# EasyEDA Pro project 2024-4T-MNT-3.eprj

# Schematic EDA-TEST2
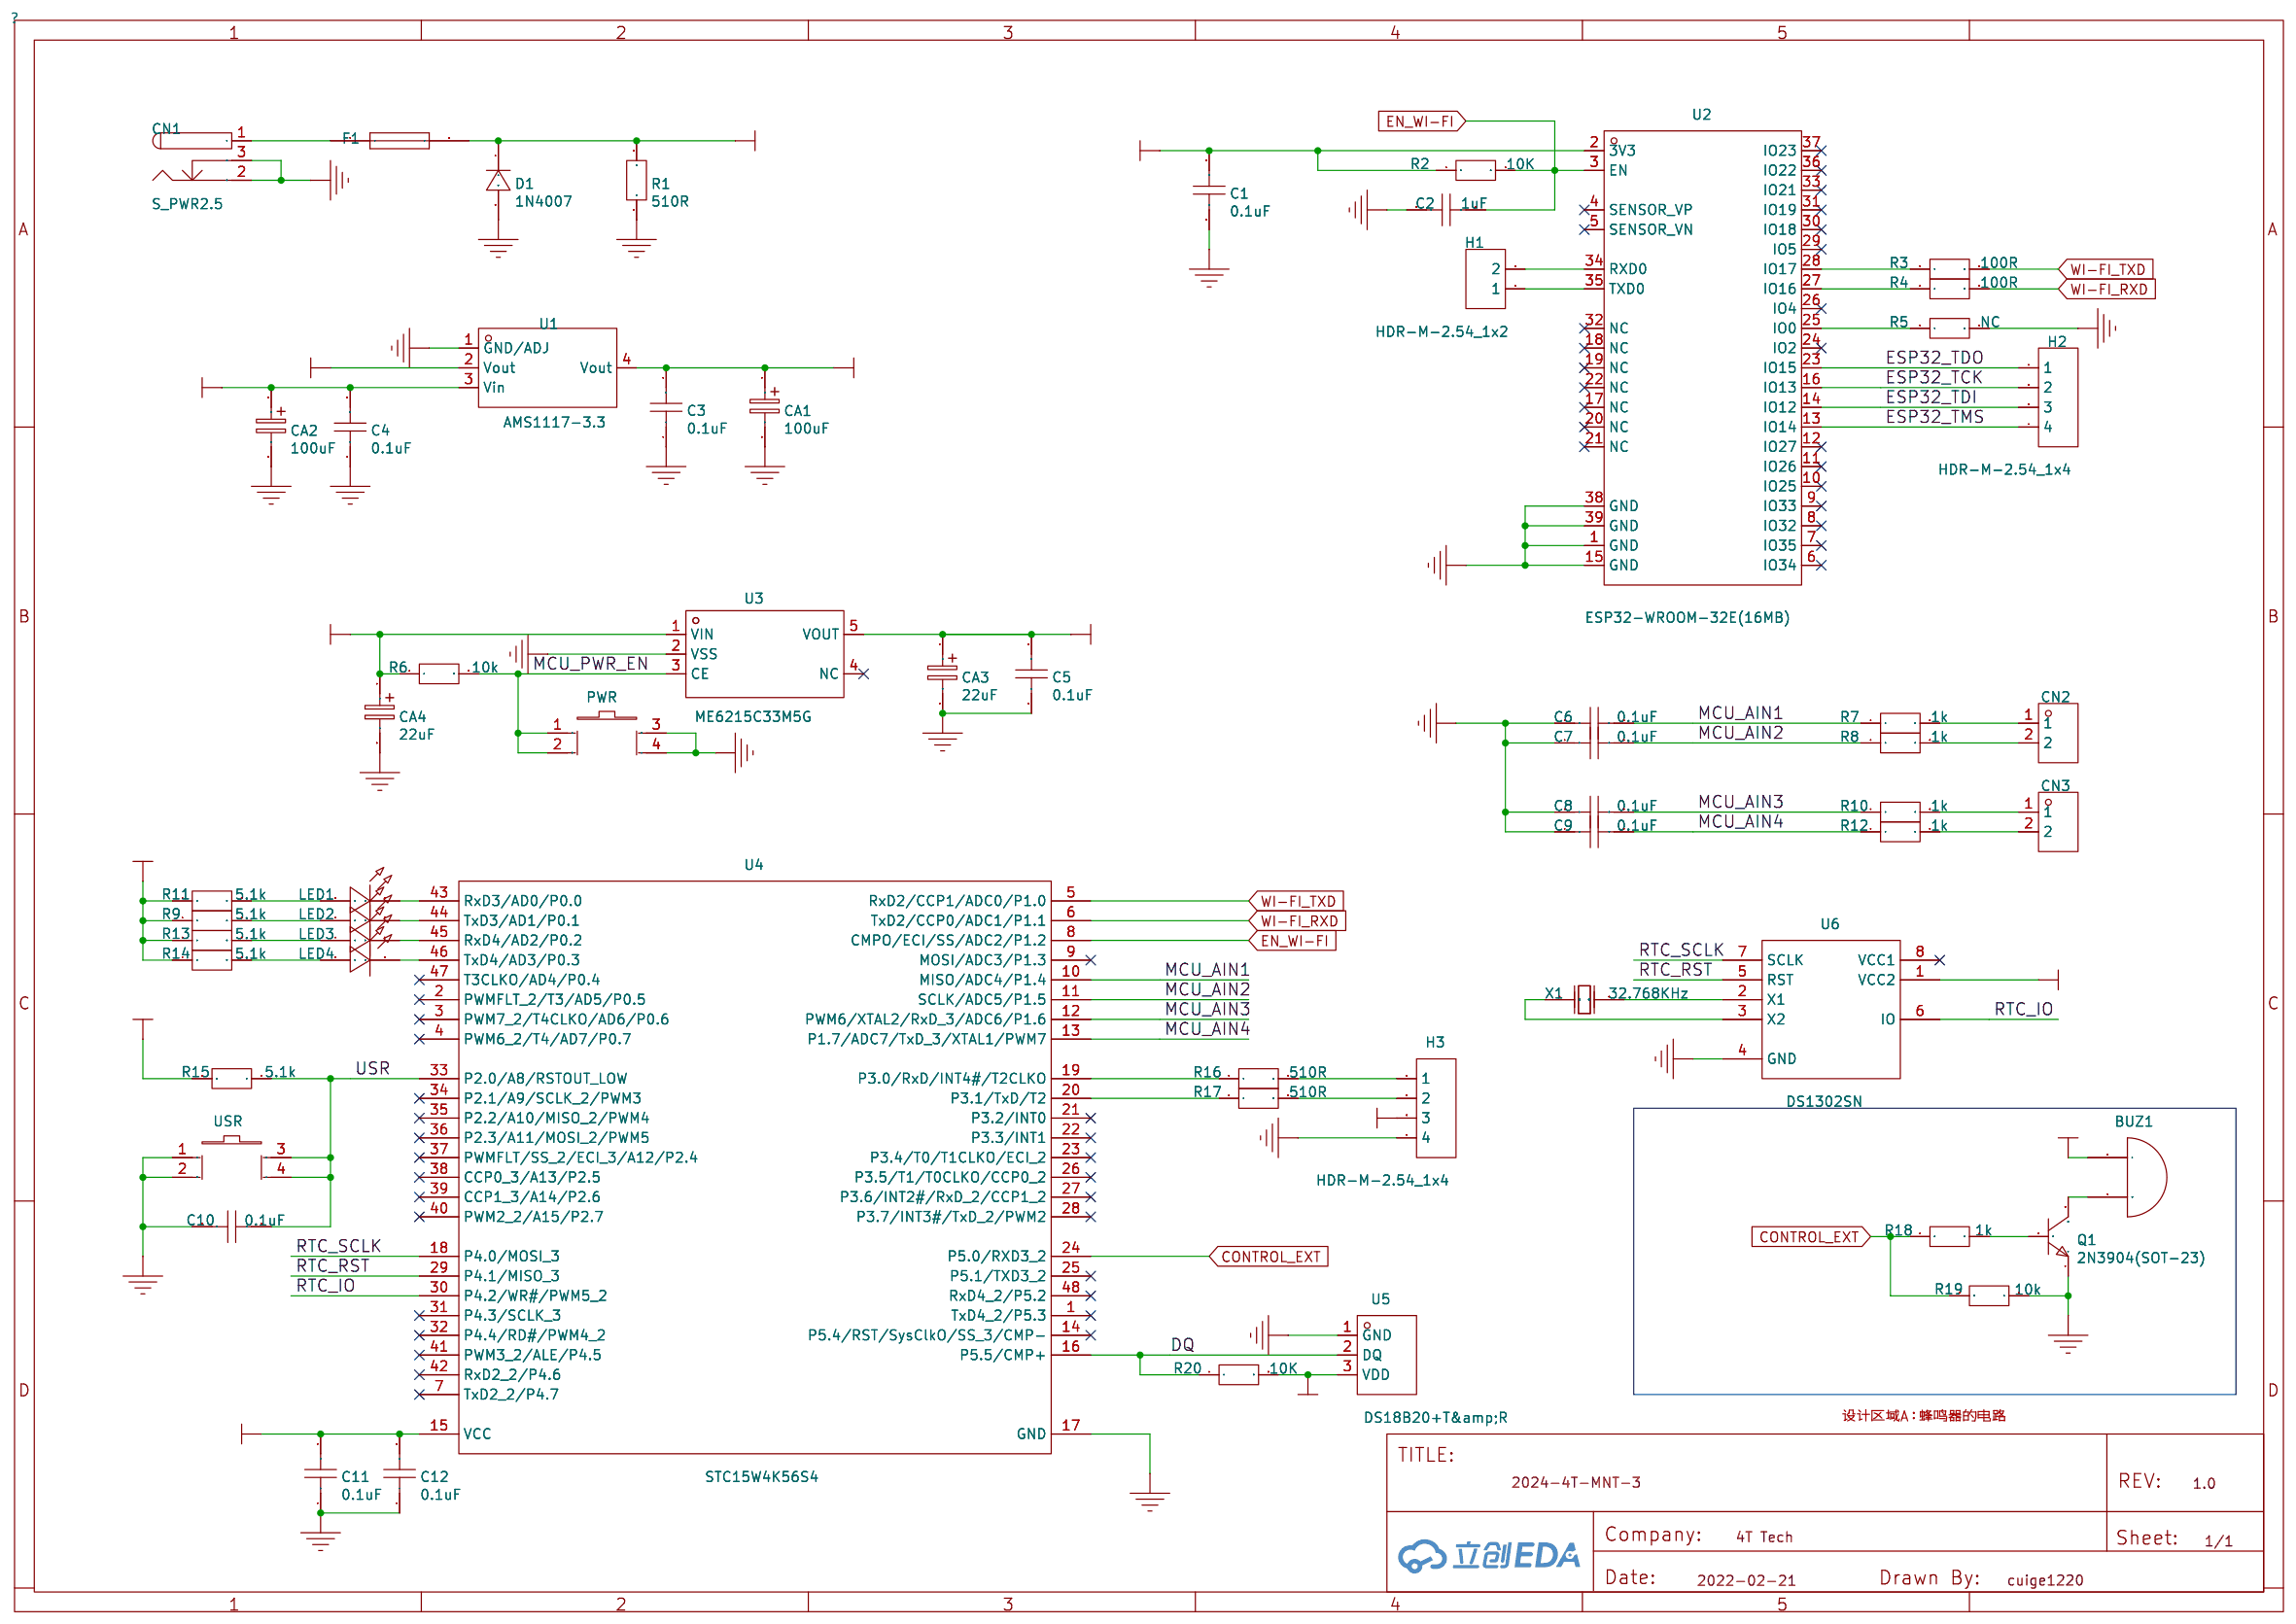
[diagram p0: schematic sheet]

## Parts
BUZ1  BUZ1  [BUZZ]
C1  0.1uF  [C0805]
C2  1uF  [C0805]
C3  0.1uF  [C0805]
C4  0.1uF  [C0805]
C5  0.1uF  [C0805]
C6  0.1uF  [C0805]
C7  0.1uF  [C0805]
C8  0.1uF  [C0805]
C9  0.1uF  [C0805]
C10  0.1uF  [C0805]
C11  0.1uF  [C0805]
C12  0.1uF  [C0805]
CA1  100uF  [C_CAP-6*H]
CA2  100uF  [C_CAP-6*H]
CA3  22uF  [C_CAP-6*H]
CA4  22uF  [C_CAP-6*H]
CN1  S_PWR2.5  [PWR2.5]
CN2  DB128L-5.08-2P  [SIP2-5.08-A]
CN3  DB128L-5.08-2P  [SIP2-5.08-A]
D1  1N4007  [DIODE-0.8]
F1  ASMD1210-075  [R_R1210]
H1  HDR-M-2.54_1x2  [HDR-M-2.54_1X2]
H2  HDR-M-2.54_1x4  [HDR-M-2.54_1X4]
H3  HDR-M-2.54_1x4  [HDR-M-2.54_1X4]
LED1  LED-TH-3mm_R  [D_LED-5MM]
LED2  LED-TH-3mm_R  [D_LED-5MM]
LED3  LED-TH-3mm_R  [D_LED-5MM]
LED4  LED-TH-3mm_R  [D_LED-5MM]
PWR  6x6x6Plastic head  [SW-SMD_4P]
Q1  2N3904(SOT-23)  [SOT-23-3_L2.9-W1.3-P1.90-LS2.4-BR]
R1  510R  [R0805]
R2  10K  [R0805]
R3  100R  [R0805]
R4  100R  [R0805]
R5  NC  [R0805]
R6  10k  [R0805]
R7  1k  [R0805]
R8  1k  [R0805]
R9  5.1k  [R0805]
R10  1k  [R0805]
R11  5.1k  [R0805]
R12  1k  [R0805]
R13  5.1k  [R0805]
R14  5.1k  [R0805]
R15  5.1k  [R0805]
R16  510R  [R0805]
R17  510R  [R0805]
R18  1k  [R0805]
R19  10k  [R0805]
R20  10K  [R0805]
U1  AMS1117-3.3  [SOP-SOT-223]
U2  ESP32-WROOM-32E(16MB)  [ESP32-WROOM-32E]
U3  ME6215C33M5G  [SOP-5]
U4  STC15W4K56S4  [QFP-LQFP-48]
U5  DS18B20+T&amp;R  [T092CS]
U6  DS1302SN  [SOP-8_L4.9-W3.9-P1.27-LS6.0-BL]
USR  6x6x6Plastic head  [SW-SMD_4P]
X1  32.768KHz  [XTAL-DT38]

## Library data of the parts
BUZ1 = BUZ1
C1 C3-C12 = 0.1uF
C2 = 1uF
CA1 CA2 = 100uF
CA3 CA4 = 22uF
CN1 = S_PWR2.5
CN2 CN3 = DB128L-5.08-2P: Supplier: LCSC; Supplier Part: C395868; Manufacturer: DIBO
D1 = 1N4007: Supplier: LCSC; Manufacturer: SEMTECH; Supplier Part: C106903
F1 = ASMD1210-075: Published: 8-Jun-2000; LatestRevisionDate: 17-Jul-2002; LatestRevisionNote: Re-released for DXP Platform.; PackageReference: PIN-W2/E2.8; Publisher: Altium Limited; PackageDescription: Thru-Hole; 2 Leads
H1 = HDR-M-2.54_1x2: Supplier Part: C124375; Supplier: LCSC
H2 H3 = HDR-M-2.54_1x4: Supplier Part: C124378; Supplier: LCSC
LED1-LED4 = 204-10SDRD/S530-A3-L: Manufacturer: EVERLIGHT(台湾亿光); Supplier Part: C84774; Supplier: LCSC
PWR USR = 6x6x6Plastic head: Supplier Part: C23550; Supplier: LCSC; Manufacturer: ReliaPro; image: http://image.lceda.cn/szlcsc/C23550.jpg
Q1 = 2n3904S-RTK/PS: Supplier: LCSC; Manufacturer: KEC; Supplier Part: C18536; Paste Type: SOT-23
R1 R16 R17 = 510R
R2 R6 R19 R20 = 10k
R3 R4 = 100R
R5 = NC
R7 R8 R10 R12 R18 = 1k
R9 R11 R13-R15 = 5.1k
U1 = AMS1117-3.3: Supplier: LCSC; Manufacturer: AMS; image: //image.lceda.cn/szlcsc/C6186.jpg; Supplier Part: C6186; JLCPCB Part Class: Basic; JLCPCB SMD: Yes
U2 = ESP32-WROOM-32E(16MB): Supplier: LCSC; Supplier Part: C701343; Manufacturer: Espressif Systems; JLCPCB Part Class: Extended Part
U3 = ME6215C33M5G: Supplier: LCSC; Manufacturer: MICRONE; Supplier Part: C84119; JLCPCB Part Class: Extend
U4 = STC15W4K56S4: Supplier: LCSC; Manufacturer: STC; image: //image.lceda.cn/szlcsc/C81639.jpg; Supplier Part: C81639; JLCPCB Part Class: Extend
U5 = DS18B20+T&R: Supplier: LCSC; Supplier Part: C880672; Manufacturer: MAXIM(美信); JLCPCB Part Class: Extended Part
U6 = DS1302SN: Trickle Charge Timekeeping Chip
X1 = CFS-20632768EZFB: Supplier: LCSC; Supplier Part: C326534; Manufacturer: CITIZEN

## Nets
3.3V_MCU: BUZ1.1(A) C5.2 C11.2 C12.2 CA3.1 H3.3 R9.1 R11.1 R13.1 R14.1 R15.2 R20.2 U3.5(VOUT) U4.15(VCC) U5.3(VDD) U6.1(VCC2)
3.3V_WIFI: C1.2 C3.2 CA1.1 R2.1 U1.2(Vout) U1.4(Vout) U2.2(3V3)
+5V0: C4.2 CA2.1 CA4.1 D1.1 F1.2 R1.2 R6.1 U1.3(Vin) U3.1(VIN)
GND: C1.1 C2.2 C3.1 C4.1 C5.1 C6.1 C7.1 C8.1 C9.1 C10.2 C11.1 C12.1 CA1.2 CA2.2 CA3.2 CA4.2 CN1.2 CN1.3 D1.2 H3.4 PWR.3 PWR.4 Q1.1(E) R1.1 R5.2 R19.1 U1.1(GND/ADJ) U2.1(GND) U2.15(GND) U2.38(GND) U2.39(GND) U3.2(VSS) U4.17(GND) U5.1(GND) U6.4(GND) USR.1 USR.2
CONTROL_EXT: R18.2 R19.2 U4.24(P5.0/RXD3_2)
DQ: R20.1 U4.16(P5.5/CMP+) U5.2(DQ)
EN_WI-FI: C2.1 R2.2 U2.3(EN) U4.8(CMPO/ECI/SS/ADC2/P1.2)
ESP32_TCK: H2.2 U2.16(IO13)
ESP32_TDI: H2.3 U2.14(IO12)
ESP32_TDO: H2.1 U2.23(IO15)
ESP32_TMS: H2.4 U2.13(IO14)
MCU_AIN1: C6.2 R7.1 U4.10(MISO/ADC4/P1.4)
MCU_AIN2: C7.2 R8.1 U4.11(SCLK/ADC5/P1.5)
MCU_AIN3: C8.2 R10.1 U4.12(PWM6/XTAL2/RxD_3/ADC6/P1.6)
MCU_AIN4: C9.2 R12.1 U4.13(P1.7/ADC7/TxD_3/XTAL1/PWM7)
MCU_PWR_EN: PWR.1 PWR.2 R6.2 U3.3(CE)
RTC_IO: U4.30(P4.2/WR#/PWM5_2) U6.6(IO)
RTC_RST: U4.29(P4.1/MISO_3) U6.5(RST)
RTC_SCLK: U4.18(P4.0/MOSI_3) U6.7(SCLK)
USR: C10.1 R15.1 U4.33(P2.0/A8/RSTOUT_LOW) USR.3 USR.4
WI-FI_RXD: R4.2 U4.6(TxD2/CCP0/ADC1/P1.1)
WI-FI_TXD: R3.2 U4.5(RxD2/CCP1/ADC0/P1.0)
$1N157: R4.1 U2.27(IO16)
$1N158: R3.1 U2.28(IO17)
$1N183: H1.2 U2.34(RXD0)
$1N184: H1.1 U2.35(TXD0)
$1N223: R5.1 U2.25(IO0)
$1N393: CN2.1 R7.2
$1N403: CN2.2 R8.2
$1N404: CN3.1 R10.2
$1N405: CN3.2 R12.2
$1N495: CN1.1 F1.1
$1N538: R16.1 U4.19(P3.0/RxD/INT4#/T2CLKO)
$1N539: H3.1 R16.2
$1N549: R17.1 U4.20(P3.1/TxD/T2)
$1N550: H3.2 R17.2
$1N579: LED1.1 R9.2
$1N580: LED1.2 U4.43(RxD3/AD0/P0.0)
$1N581: LED2.1 R11.2
$1N601: LED3.1 R13.2
$1N621: LED4.1 R14.2
$1N641: LED3.2 U4.45(RxD4/AD2/P0.2)
$1N642: LED4.2 U4.46(TxD4/AD3/P0.3)
$1N643: LED2.2 U4.44(TxD3/AD1/P0.1)
$1N806: U6.2(X1) X1.2(OSC2)
$1N807: U6.3(X2) X1.1(OSC1)
$1N3385: BUZ1.2(B) Q1.3(C)
$1N3396: Q1.2(B) R18.1

Not connected (* = marked no-connect by the designer): U2 4(SENSOR_VP)* 5(SENSOR_VN)* 6(IO34)* 7(IO35)* 8(IO32)* 9(IO33)* 10(IO25)* 11(IO26)* 12(IO27)* 17(NC)* 18(NC)* 19(NC)* 20(NC)* 21(NC)* 22(NC)* 24(IO2)* 26(IO4)* 29(IO5)* 30(IO18)* 31(IO19)* 32(NC)* 33(IO21)* 36(IO22)* 37(IO23)*; U3 4(NC)*; U4 1(TxD4_2/P5.3)* 2(PWMFLT_2/T3/AD5/P0.5)* 3(PWM7_2/T4CLKO/AD6/P0.6)* 4(PWM6_2/T4/AD7/P0.7)* 7(TxD2_2/P4.7)* 9(MOSI/ADC3/P1.3)* 14(P5.4/RST/SysClkO/SS_3/CMP-)* 21(P3.2/INT0)* 22(P3.3/INT1)* 23(P3.4/T0/T1CLKO/ECI_2)* 25(P5.1/TXD3_2)* 26(P3.5/T1/T0CLKO/CCP0_2)* 27(P3.6/INT2#/RxD_2/CCP1_2)* 28(P3.7/INT3#/TxD_2/PWM2)* 31(P4.3/SCLK_3)* 32(P4.4/RD#/PWM4_2)* 34(P2.1/A9/SCLK_2/PWM3)* 35(P2.2/A10/MISO_2/PWM4)* 36(P2.3/A11/MOSI_2/PWM5)* 37(PWMFLT/SS_2/ECI_3/A12/P2.4)* 38(CCP0_3/A13/P2.5)* 39(CCP1_3/A14/P2.6)* 40(PWM2_2/A15/P2.7)* 41(PWM3_2/ALE/P4.5)* 42(RxD2_2/P4.6)* 47(T3CLKO/AD4/P0.4)* 48(RxD4_2/P5.2)*; U6 8(VCC1)*

## Notes on the sheet
- 设计区域A：蜂鸣器的电路

# Board PCB9
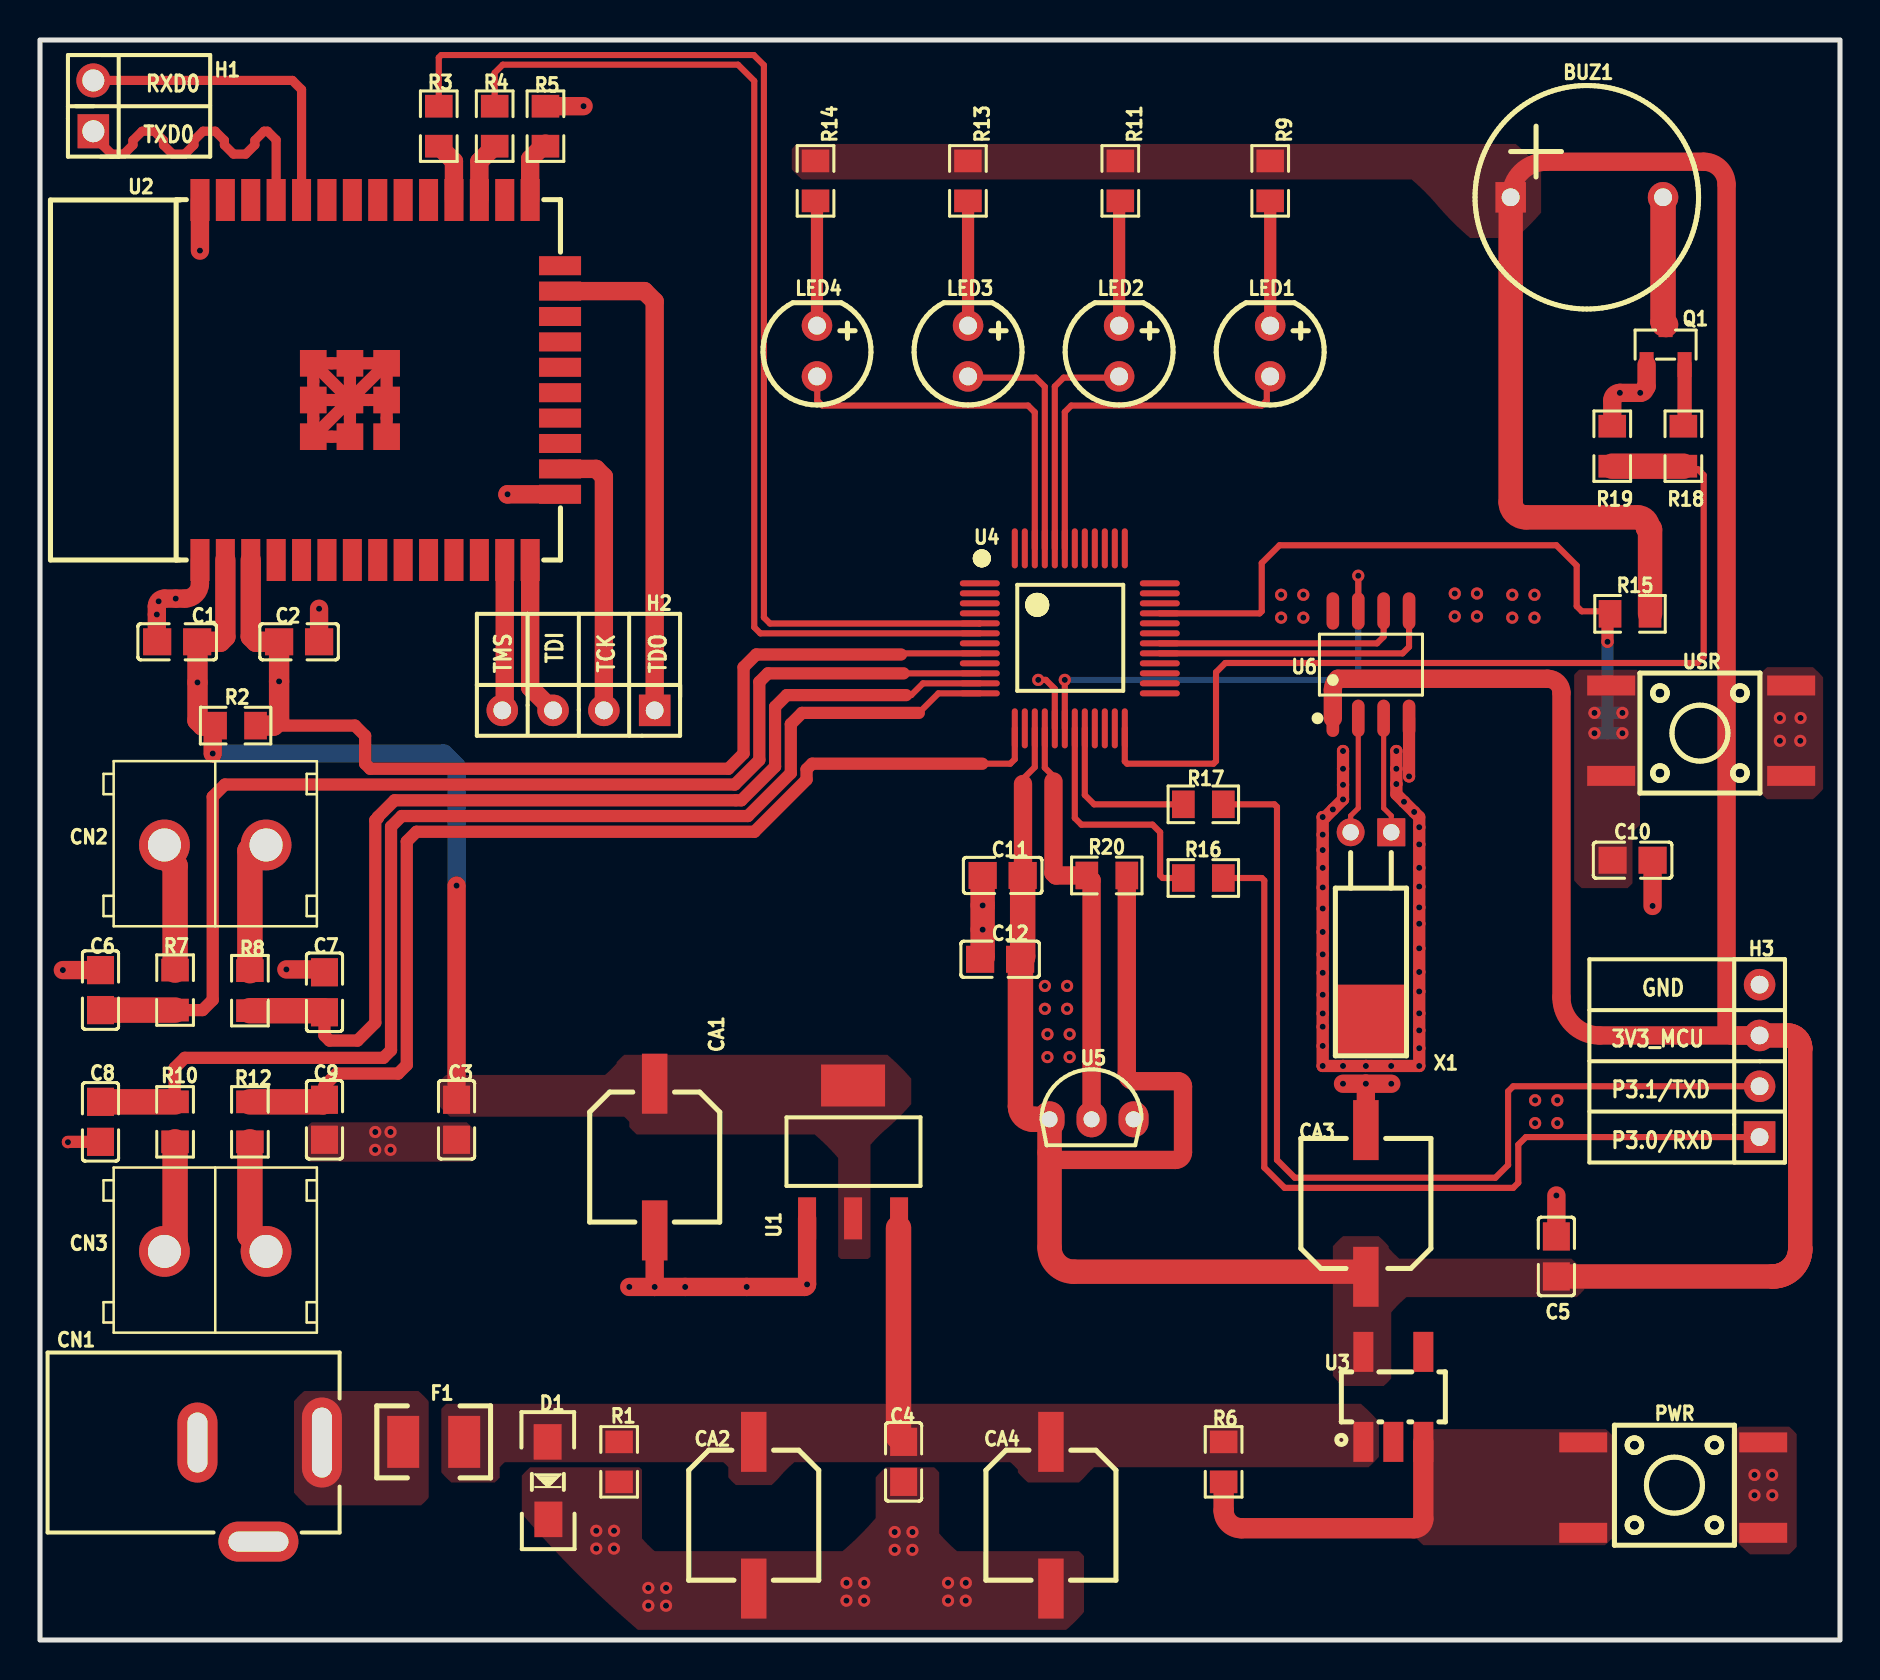
[diagram p1: board, top side]
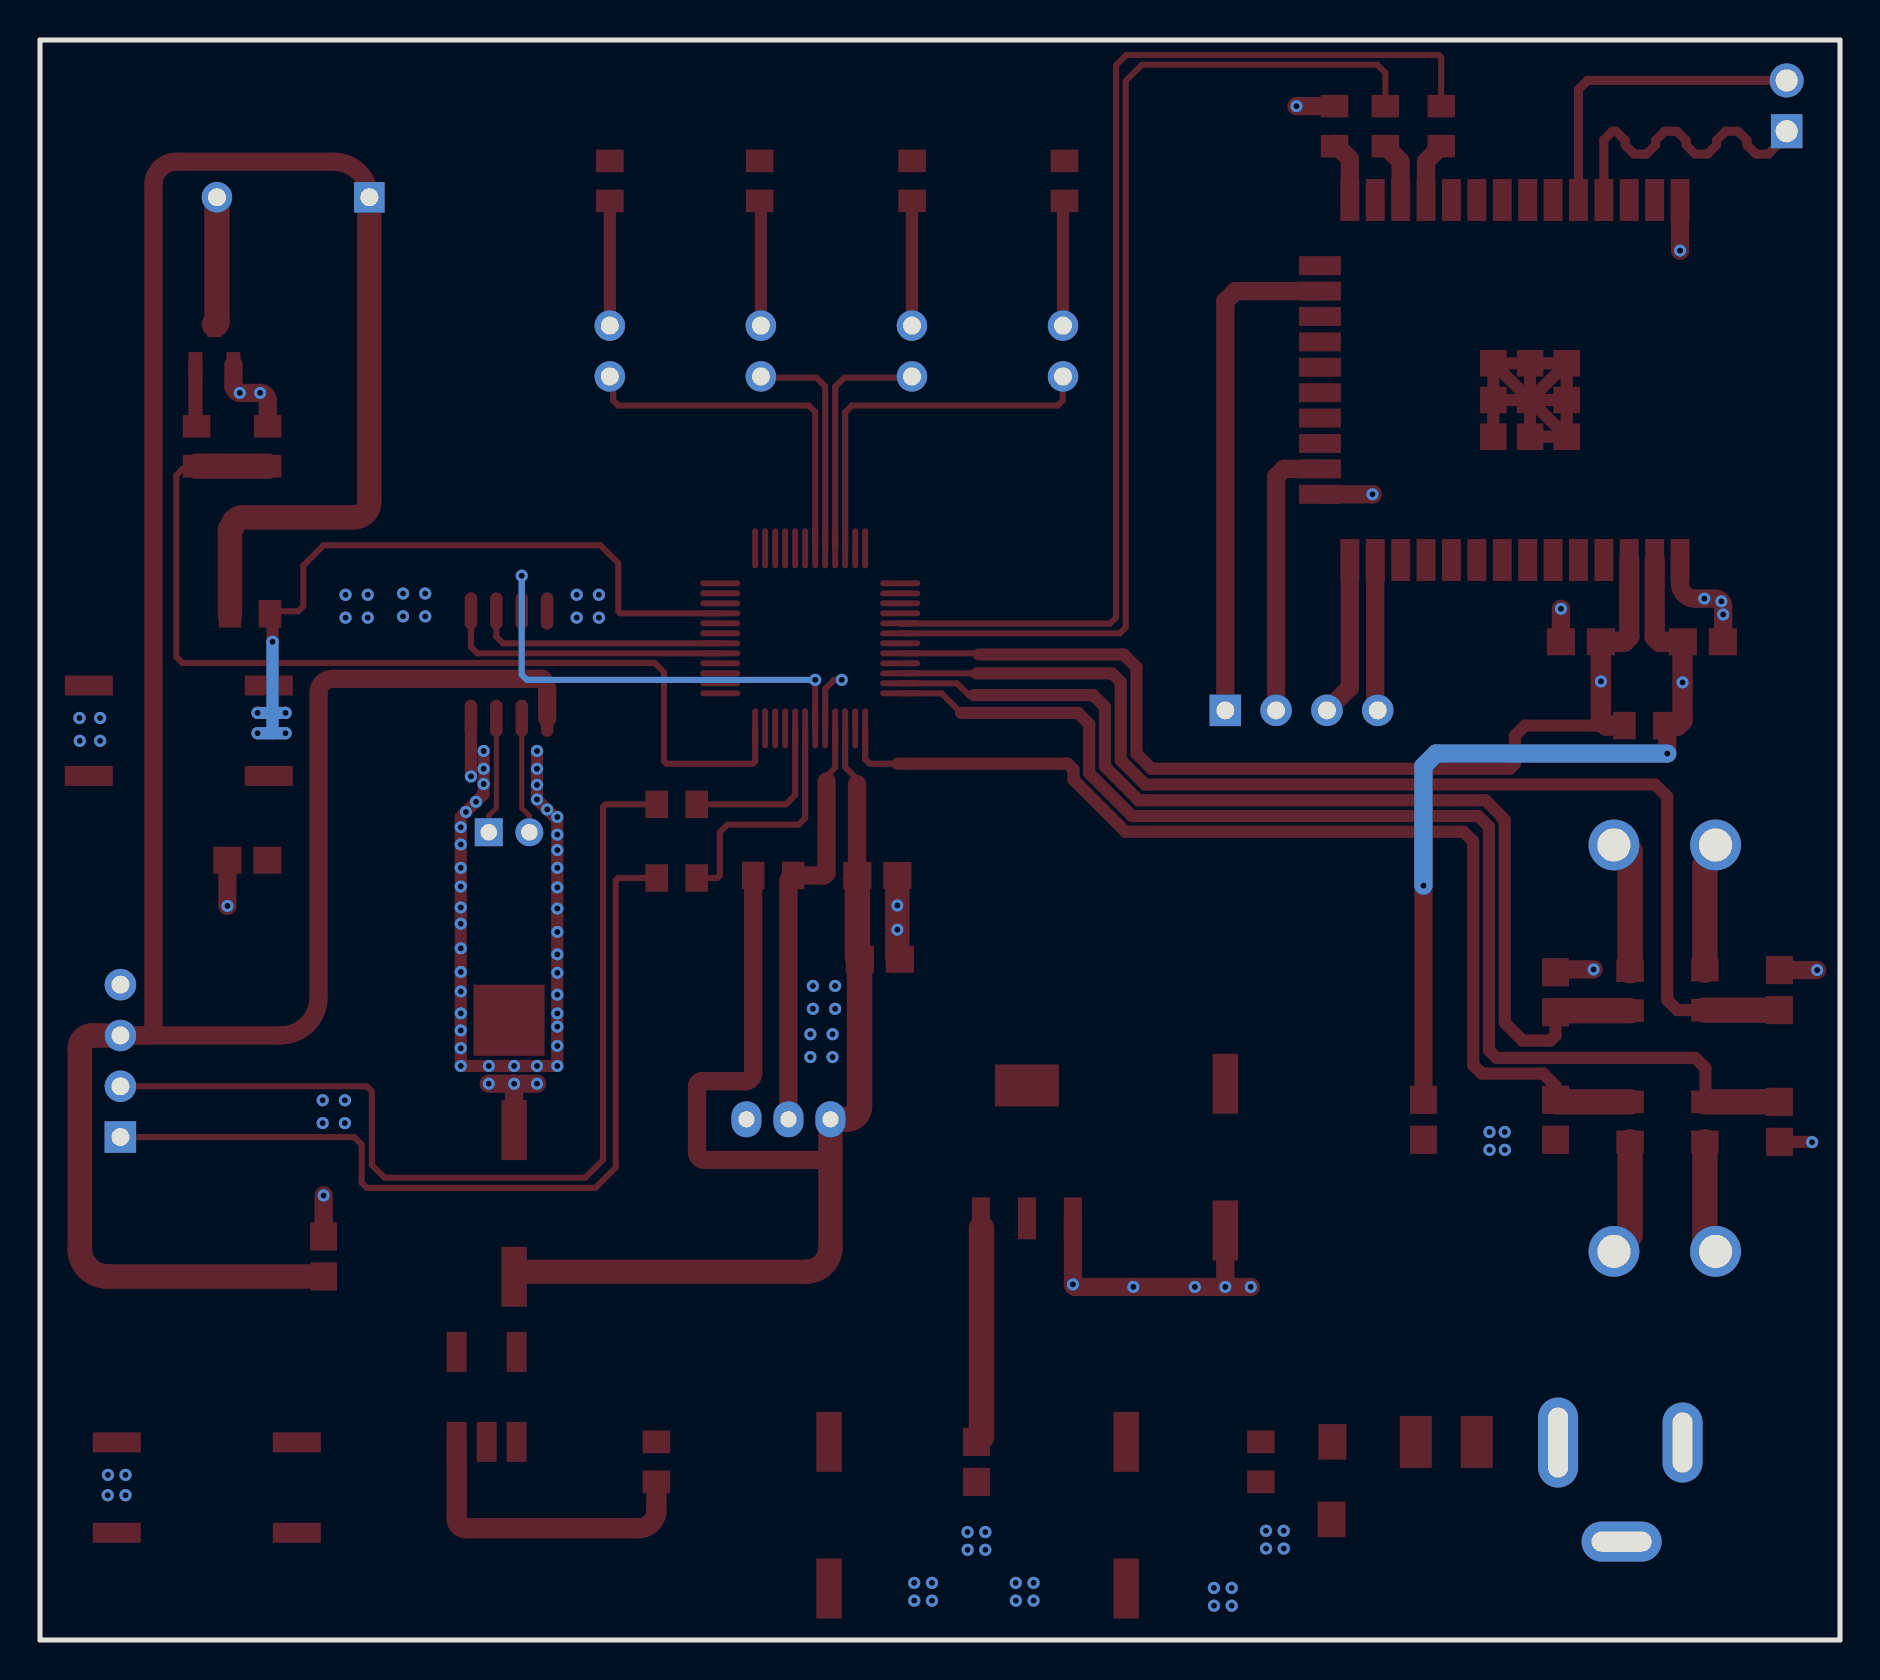
[diagram p2: board, bottom side, seen from below]

Outline 90 x 80 mm; copper layers: Top Layer, Bottom Layer. Coordinates in mm from the lower left corner of the outline.
Outline path: rectangle 0,80 90,0
Stack: Top Layer 0.035mm / Dielectric1 1.51mm FR4 er 4.5 / Bottom Layer 0.035mm

## Design rules (mm)
net $1N183: DP2
net $1N184: DP2
net $1N806: DP1
net $1N807: DP1
template: 自定义配置
spacing copperThickness1oz (default): track to track 0.178, other pairs 0.152 to 0.3
spacing copperThickness2oz: track to track 0.203, other pairs 0.152 to 0.3
track width copperThickness1oz (default): min 0.254, default 0.305, max 2.54
track width copperThickness2oz: min 0.203, default 0.254, max 2.54
track width PWR: min 0.254, default 0.61, max 2.54
differential pair differentialPair (default): width min 0.127, default 0.254, max 2.54; gap min 0.152, default 0.152
via viaSize (default): diameter min 0.5, default 0.61, max 10; hole min 0.3, default 0.305, max 6.299
net 3.3V_WIFI uses PWR
net GND uses PWR
net +5V0 uses PWR
net 3.3V_MCU uses PWR

## Placement (name value [footprint] x y rotation side)
BUZ1  BUZ1  [BUZZ]  73.53 72.14 0 top
C1  0.1uF  [C0805]  6.86 49.91 0 top
C2  1uF  [C0805]  12.95 49.91 0 top
C3  0.1uF  [C0805]  20.83 26.01 90 top
C4  0.1uF  [C0805]  43.18 8.91 90 top
C5  0.1uF  [C0805]  75.82 19.18 270 top
C6  0.1uF  [C0805]  3.03 32.5 270 top
C7  0.1uF  [C0805]  14.22 32.39 270 top
C8  0.1uF  [C0805]  3.03 25.91 90 top
C9  0.1uF  [C0805]  14.22 26.01 90 top
C10  0.1uF  [C0805]  79.63 38.99 0 top
C11  0.1uF  [C0805]  48.13 38.23 0 top
C12  0.1uF  [C0805]  48.01 34.04 0 top
CA1  100uF  [C_CAP-6*H]  30.73 27.81 270 top
CA2  100uF  [C_CAP-6*H]  35.69 9.91 270 top
CA3  22uF  [C_CAP-6*H]  66.29 18.16 90 top
CA4  22uF  [C_CAP-6*H]  50.55 9.91 270 top
CN1  S_PWR2.5  [PWR2.5]  8 10 0 top
CN2  DB128L-5.08-2P  [SIP2-5.08-A]  6.22 39.75 0 top
CN3  DB128L-5.08-2P  [SIP2-5.08-A]  6.22 19.43 0 top
D1  1N4007  [DIODE-0.8]  25.4 7.97 270 top
F1  ASMD1210-075  [R_R1210]  18.16 9.91 0 top
H1  HDR-M-2.54_1x2  [HDR-M-2.54_1X2]  2.67 76.71 90 top
H2  HDR-M-2.54_1x4  [HDR-M-2.54_1X4]  26.92 46.48 180 top
H3  HDR-M-2.54_1x4  [HDR-M-2.54_1X4]  85.98 28.96 90 top
LED1  LED-TH-3mm_R  [D_LED-5MM]  61.51 64.45 0 top
LED2  LED-TH-3mm_R  [D_LED-5MM]  53.96 64.45 0 top
LED3  LED-TH-3mm_R  [D_LED-5MM]  46.4 64.45 0 top
LED4  LED-TH-3mm_R  [D_LED-5MM]  38.85 64.45 0 top
PWR  6x6x6Plastic head  [SW-SMD_4P]  81.66 7.62 0 top
Q1  2N3904(SOT-23)  [SOT-23-3_L2.9-W1.3-P1.90-LS2.4-BR]  81.28 64.77 270 top
R1  510R  [R0805]  28.96 8.91 90 top
R2  10K  [R0805]  9.78 45.72 0 top
R3  100R  [R0805]  19.94 75.69 90 top
R4  100R  [R0805]  22.73 75.69 90 top
R5  NC  [R0805]  25.27 75.69 90 top
R6  10k  [R0805]  59.18 8.91 270 top
R7  1k  [R0805]  6.75 32.5 90 top
R8  1k  [R0805]  10.5 32.47 90 top
R9  5.1k  [R0805]  61.51 72.95 270 top
R10  1k  [R0805]  6.75 25.91 270 top
R11  5.1k  [R0805]  54.02 72.95 270 top
R12  1k  [R0805]  10.5 25.91 270 top
R13  5.1k  [R0805]  46.4 72.95 270 top
R14  5.1k  [R0805]  38.78 72.95 270 top
R15  5.1k  [R0805]  79.5 51.31 0 top
R16  510R  [R0805]  58.17 38.1 0 top
R17  510R  [R0805]  58.17 41.78 0 top
R18  1k  [R0805]  82.17 59.69 270 top
R19  10k  [R0805]  78.61 59.69 270 top
R20  10K  [R0805]  53.34 38.23 0 top
U1  AMS1117-3.3  [SOP-SOT-223]  38.35 21.08 90 top
U2  ESP32-WROOM-32E(16MB)  [ESP32-WROOM-32E]  17 63 0 top
U3  ME6215C33M5G  [SOP-5]  66.17 9.91 0 top
U4  STC15W4K56S4  [QFP-LQFP-48]  46.99 52.83 0 top
U5  DS18B20+T&amp;R  [T092CS]  52.58 26.03 90 top
U6  DS1302SN  [SOP-8_L4.9-W3.9-P1.27-LS6.0-BL]  66.55 48.77 0 top
USR  6x6x6Plastic head  [SW-SMD_4P]  83.06 45.47 180 top
X1  32.768KHz  [XTAL-DT38]  67.56 40.39 0 top

## Footprints (pads in the part's own frame, mm; a bottom-side part is the same pattern mirrored in y, then rotated)
BUZZ
  rect 1.524x1.524 hole 0.894x0.889: 1(0,0)
  round 1.524 hole 0.894x0.889: 2(7.62,0)
C0805
  rect 1.41x1.35 smd: 1(-1,0) 2(1,0)
C_CAP-6*H
  rect 3x1.274 smd: 1(-0.001,0.001) 2(7.333,0.001)
D_LED-5MM
  round 1.524 hole 0.889x0.894: 1(0,1.27) 2(0,-1.27)
DIODE-0.8
  rect 1.778x1.397 smd: 1(-1.937,-0.018) 2(1.938,0.018)
ESP32-WROOM-32E
  rect 0.95x2.1 smd: 1(-9.002,-9) 2(-7.732,-9) 3(-6.463,-9) 4(-5.192,-9) 5(-3.922,-9) 6(-2.652,-9) 7(-1.383,-9) 8(-0.113,-9) 9(1.157,-9) 10(2.428,-9) 11(3.697,-9) 12(4.968,-9) 13(6.237,-9) 14(7.508,-9) 25(7.508,9) 26(6.237,9) 27(4.968,9) 28(3.697,9) 29(2.428,9) 30(1.157,9) 31(-0.113,9) 32(-1.383,9) 33(-2.652,9) 34(-3.922,9) 35(-5.192,9) 36(-6.463,9) 37(-7.732,9) 38(-9.002,9)
  rect 2.1x0.95 smd: 15(9.002,-5.715) 16(9.002,-4.444) 17(9.002,-3.175) 18(9.002,-1.905) 19(9.002,-0.634) 20(9.002,0.635) 21(9.002,1.905) 22(9.002,3.175) 23(9.002,4.446) 24(9.002,5.715)
  rect 1.33x1.33 smd: 39(-1.502,-1) 40(-1.502,-2.835) 41(-1.502,0.835) 42(-3.337,0.835) 43(-3.337,-1) 44(-3.337,-2.835) 45(0.333,-2.835) 46(0.333,-1) 47(0.333,0.835)
HDR-M-2.54_1X2
  rect 1.7x1.575 hole 1.1: 1(-1.27,0)
  round 1.7 hole 1.1: 2(1.27,0)
HDR-M-2.54_1X4
  rect 1.575x1.575 hole 0.889: 1(-3.81,0)
  round 1.575 hole 0.889: 2(-1.27,0) 3(1.27,0) 4(3.81,0)
PWR2.5
  oval 2x4.5 hole 1x3.5: 1(6.096,-0.127)
  oval 2x4 hole 1x3: 2(-0.127,-0.127)
  oval 4x2 hole 3x1: 3(2.921,-5.08)
QFP-LQFP-48
  oval 2x0.3 smd: 1(0,0) 2(0,-0.5) 3(0,-1) 4(0,-1.5) 5(0,-2) 6(0,-2.5) 7(0,-3) 8(0,-3.5) 9(0,-4) 10(0,-4.5) 11(0,-5) 12(0,-5.5) 25(9,-5.5) 26(9,-5) 27(9,-4.5) 28(9,-4) 29(9,-3.5) 30(9,-3) 31(9,-2.5) 32(9,-2) 33(9,-1.5) 34(9,-1) 35(9,-0.5) 36(9,0)
  oval 0.3x2 smd: 13(1.75,-7.25) 14(2.25,-7.25) 15(2.75,-7.25) 16(3.25,-7.25) 17(3.75,-7.25) 18(4.25,-7.25) 19(4.75,-7.25) 20(5.25,-7.25) 21(5.75,-7.25) 22(6.25,-7.25) 23(6.75,-7.25) 24(7.25,-7.25) 37(7.25,1.75) 38(6.75,1.75) 39(6.25,1.75) 40(5.75,1.75) 41(5.25,1.75) 42(4.75,1.75) 43(4.25,1.75) 44(3.75,1.75) 45(3.25,1.75) 46(2.75,1.75) 47(2.25,1.75) 48(1.75,1.75)
R0805
  rect 1.133x1.377 smd: 1(-1,0) 2(1,0)
R_R1210
  rect 1.6x2.6 smd: 1(0,0) 2(3.048,0)
SIP2-5.08-A
  round 2.54 hole 1.651: 1(0,0) 2(5.08,0)
SOP-5
  rect 1x2 smd: 1(0,0) 2(1.5,0) 3(3,0) 4(3,4.5) 5(0,4.5)
SOP-8_L4.9-W3.9-P1.27-LS6.0-BL
  oval 0.63x1.865 smd: 1(-1.905,-2.683) 2(-0.635,-2.683) 3(0.635,-2.683) 4(1.905,-2.683) 5(1.905,2.683) 6(0.635,2.683) 7(-0.635,2.683) 8(-1.905,2.683)
SOP-SOT-223
  rect 2.1x0.9 smd: 1(0,0) 2(0,-2.3) 3(0,-4.6)
  rect 2.1x3.2 smd: 4(6.644,-2.3)
SOT-23-3_L2.9-W1.3-P1.90-LS2.4-BR
  rect 1.25x0.7 smd: 1(1,-0.95) 2(1,0.95) 3(-1,0)
SW-SMD_4P
  rect 2.4x1 smd: 1(-4.5,2.26) 2(-4.5,-2.26) 3(4.5,-2.26) 4(4.5,2.26)
T092CS
  oval 1.8x1.5 hole 0.8: 1(0,-2.1) 2(0,0) 3(0,2.1)
XTAL-DT38
  rect 3.556x3.556 smd: 0(-1.016,-9.398)
  rect 1.397x1.397 hole 0.818x0.813: 1(0,0)
  round 1.397 hole 0.818x0.813: 2(-2.032,0)

## Nets
As in the schematic, except:
GND: C1.1 C2.2 C3.1 C4.1 C5.1 C6.1 C7.1 C8.1 C9.1 C10.2 C11.1 C12.1 CA1.2 CA2.2 CA3.2 CA4.2 CN1.2 CN1.3 D1.2 H3.4 PWR.3 PWR.4 Q1.1 R1.1 R5.2 R19.1 U1.1 U2.1 U2.15 U2.38 U2.39 U2.40 U2.41 U2.42 U2.43 U2.44 U2.45 U2.46 U2.47 U3.2 U4.17 U5.1 U6.4 USR.1 USR.2

Pads without a net: U2 4 5 6 7 8 9 10 11 12 17 18 19 20 21 22 24 26 29 30 31 32 33 36 37; U3 4; U4 1 2 3 4 7 9 14 21 22 23 25 26 27 28 31 32 34 35 36 37 38 39 40 41 42 47 48; U6 8; X1 0

## Via types
v1: diameter 0.61, hole 0.305, Top Layer to Bottom Layer, 133 vias

## Routing (per net, layer and track width the routed paths; a pad name or vN(x,y) marks a point on that pad's centre or on a via; arc(x,y) is an arc through that point)
3.3V_MCU: length 223
  Top Layer w0.305: 49.15,42.8 49.15,43.05 49.74,43.64 U4.15
  Top Layer w0.914: U6.1 64.64,47.5 arc(64.71,47.81) 64.89,48.06 75.38,48.06 arc(75.87,47.86) 76.07,47.37 76.07,32.13 arc(76.63,30.78) 77.98,30.23 H3.3 84.58,30.23 arc(84.4,30.3) 84.33,30.48 84.33,72.77 arc(83.99,73.58) 83.19,73.91 75.31,73.91 arc(74.05,73.39) BUZ1.1 ; 49.15,42.8 49.15,38.24 C11.2 ; R20.2 54.34,28.34 arc(54.46,28.06) 54.74,27.94 56.9,27.94 arc(57.08,27.87) 57.15,27.69 57.15,24.38 arc(57.04,24.11) 56.77,24 50.86,24 arc(50.59,24.12) 50.48,24.39
  Top Layer w1.219: R15.2 80.5,55.52 arc(80.47,55.59) 80.39,55.63 arc(80.24,55.99) 79.88,56.13 74.29,56.13 arc(73.76,56.36) 73.53,56.9 BUZ1.1 ; 87.38,30.23 H3.3 ; 87.38,30.23 arc(87.83,30.04) 88.01,29.59 ; 87.38,30.23 arc(87.83,30.04) 88.01,29.59 ; 87.38,30.23 arc(87.83,30.04) 88.01,29.59 ; C5.2 86.63,18.18 ; 86.63,18.18 arc(87.61,18.58) 88.01,19.56 ; 86.63,18.18 arc(87.61,18.58) 88.01,19.56 ; 86.63,18.18 arc(87.61,18.58) 88.01,19.56 ; 88.01,19.56 88.01,29.59 ; U5.3 50.48,19.63 arc(50.83,18.77) 51.69,18.41 66.04,18.41 arc(66.22,18.34) CA3.1
  Top Layer w1.27: C11.2 49.13,34.16 arc(49.1,34.07) C12.2 arc(49.02,34.03) 49.02,34.02 49.02,26.67 arc(49.21,26.22) 49.66,26.03 U5.3
3.3V_WIFI: length 40.1
  Top Layer w0.914: v1(8.64,44.32) 8.64,45.58 R2.1 ; 20.83,27.8 v1(20.83,37.72)
  Top Layer w1.016: U2.2 9.27,50.16 9.02,49.91 C1.2 7.87,49.89 v1(7.87,47.88) 7.87,45.97 8.13,45.72 R2.1
  Bottom Layer w0.914: v1(20.83,37.72) 20.83,43.69 20.19,44.32 v1(8.64,44.32)
+5V0: length 10.8
  Top Layer w1.27: C4.2 42.93,10.16 42.93,20.6
GND: length 124
  Top Layer w0.305: U4.17 50.74,47.56 50.29,48.01 v1(49.91,48.01)
  Top Layer w0.61: U2.46 U2.45 ; U2.46 U2.47 ; U2.46 U2.39 ; U2.47 U2.39 ; U2.47 U2.41 ; U2.39 U2.42 ; U2.39 U2.41 ; U2.39 U2.44 ; U2.39 U2.40 U2.44 ; U2.39 U2.43 ; U2.43 U2.44 ; U2.43 U2.42 ; U2.42 U2.41 ; v1(68.45,43.18) U6.4 ; v1(65.15,44.45) v1(65.15,43.56) v1(65.15,42.76) v1(65.15,42.03) 64.27,41.15 v1(64.13,41.15) v1(64.13,40.27) v1(64.13,39.5) v1(64.13,38.61) v1(64.13,37.63) v1(64.13,36.57) v1(64.13,35.4) v1(64.13,34.28) v1(64.13,33.36) v1(64.13,32.26) v1(64.13,31.33) v1(64.13,30.67) v1(64.13,29.7) v1(64.13,28.7) v1(65.15,28.7) v1(66.29,28.7) v1(67.56,28.7) v1(68.96,28.7) v1(68.96,29.59) v1(68.96,30.48) v1(68.96,31.33) v1(68.96,32.43) v1(68.96,33.4) v1(68.96,34.58) v1(68.96,35.81) v1(68.96,36.63) v1(68.96,37.67) v1(68.96,38.61) v1(68.96,39.78) v1(68.96,40.64) 68.96,41.15 v1(68.71,41.4) v1(68.2,41.91) 67.82,42.29 v1(67.82,42.8) v1(67.82,43.56) v1(67.82,44.45) ; C8.1 1.4,24.91
  Top Layer w0.914: U2.1 8,52.83 arc(7.78,52.29) 7.24,52.07 v1(6.79,52.07) 6.22,52.07 arc(5.95,51.96) 5.84,51.69 v1(5.84,51.28) 5.84,49.93 arc(5.85,49.92) C1.1 ; C5.1 v1(75.82,22.22) ; C10.2 v1(80.63,36.7) ; U2.38 v1(8,69.47) ; C7.1 14.08,33.53 v1(12.32,33.53) ; CA1.2 v1(30.73,17.65) ; v1(30.73,17.65) v1(29.46,17.65) ; v1(30.73,17.65) v1(32.26,17.65) v1(35.34,17.65) 38.23,17.65 arc(38.32,17.69) v1(38.35,17.78) U1.1 ; Q1.1 80.33,62.68 arc(80.31,62.63) 80.26,62.61 arc(80.19,62.43) v1(80.01,62.36) v1(78.99,62.36) arc(78.72,62.25) 78.61,61.98 R19.1 ; v1(66.29,27.81) v1(65.15,27.81) ; v1(66.29,27.81) v1(67.56,27.81) ; v1(66.29,27.81) CA3.2 ; C6.1 v1(1.14,33.5) ; C2.2 v1(13.95,51.56) ; U2.15 v1(23.38,57.29) arc(23.37,57.28) 23.37,57.28 ; R5.2 v1(27.18,76.69)
  Top Layer w1.219: C11.1 v1(47.13,36.73) v1(47.13,35.52) 47.13,34.16 arc(47.1,34.07) C12.1
  vias: v1(1.4,24.89) v1(5.93,51.93) v1(16.76,25.4) v1(16.76,24.51) v1(17.53,25.4) v1(17.53,24.51) v1(27.81,5.46) v1(27.81,4.57) v1(28.7,5.46) v1(28.7,4.57) v1(30.42,2.6) v1(30.42,1.71) v1(31.31,2.6) v1(31.3,1.71) v1(40.32,2.86) v1(40.32,1.97) v1(41.21,2.86) v1(41.21,1.97) v1(42.74,5.4) v1(42.74,4.51) v1(43.62,5.4) v1(43.62,4.51) v1(45.4,2.86) v1(45.4,1.97) v1(46.29,2.86) v1(46.29,1.97) v1(50.25,32.7) v1(50.25,31.56) v1(50.37,30.29) v1(50.37,29.15) v1(51.35,32.7) v1(51.35,31.56) v1(51.48,30.29) v1(51.48,29.15) v1(62.06,52.26) v1(62.06,51.12) v1(63.17,52.26) v1(63.17,51.12) v1(64.64,41.53) v1(70.74,52.32) v1(70.74,51.18) v1(71.85,52.32) v1(71.85,51.18) v1(73.61,52.26) v1(73.61,51.12) v1(74.72,52.26) v1(74.72,51.12) v1(74.76,26.99) v1(74.76,25.84) v1(75.87,26.99) v1(75.87,25.84) v1(85.72,8.25) v1(85.72,7.24) v1(86.6,8.25) v1(86.61,7.24) v1(87,46.1) v1(87,44.96) v1(88.03,46.1) v1(88.01,44.96)
CONTROL_EXT: length 49.3
  Top Layer w0.305: R18.2 82.31,58.55 82.88,58.55 83.19,58.24 83.19,49.15 82.88,48.85 59.26,48.85 58.8,48.39 58.8,43.94 58.67,43.81 54.36,43.81 54.24,43.93 U4.24
  Top Layer w1.27: R18.2 R19.2
DQ: length 21.4
  Top Layer w0.305: U4.16 50.24,43.61 50.67,43.18 50.67,42.93
  Top Layer w0.914: U5.2 52.58,37.99 R20.1 50.8,38.23 50.67,38.35 50.67,42.93
EN_WI-FI: length 52.5
  Top Layer w0.305: U4.8 43.11,49.33 43.05,49.28
  Top Layer w0.61: 43.05,49.28 35.81,49.28 35.18,48.64 35.18,44.32 34.42,43.56 16.51,43.56 16.26,43.81 16.26,45.21 15.75,45.72 11.68,45.72
  Top Layer w1.016: R2.2 11.68,45.72 11.95,45.99 v1(11.95,47.93) C2.1 10.8,49.91 10.54,50.17 U2.3
ESP32_TCK: length 14
  Top Layer w0.914: U2.16 27.8,58.56 28.19,58.17 H2.2
ESP32_TDI: length 8
  Top Layer w0.914: U2.14 24.51,47.63 H2.3
ESP32_TDO: length 25.4
  Top Layer w0.914: U2.23 30.22,67.45 30.73,66.93 H2.1
ESP32_TMS: length 7.6
  Top Layer w0.914: H2.4 23.24,46.61 U2.13
MCU_AIN1: length 59.2
  Top Layer w0.305: U4.10 43.18,48.33
  Top Layer w0.61: 43.18,48.33 36.39,48.33 35.97,47.9 35.97,44 34.74,42.77 9.25,42.77 8.64,42.16 8.64,32 8.13,31.5 R7.1
  Top Layer w1.27: R7.1 C6.2
MCU_AIN2: length 52.9
  Top Layer w0.305: 43.31,47.24 43.56,47.24 44.15,47.83 U4.11
  Top Layer w0.61: 34.8,41.99 35.07,41.99 36.75,43.67 36.75,46.66 37.34,47.24 43.31,47.24 ; 34.79,41.99 17.73,41.99 16.89,41.15 16.89,41.09 16.76,40.99 16.76,30.86 15.88,29.97 14.48,29.97 14.22,30.23 C7.2
  Top Layer w1.27: R8.1 14.15,31.47 C7.2
MCU_AIN3: length 61.4
  Top Layer w0.305: 43.94,46.36 44.92,47.33 U4.12
  Top Layer w0.61: R10.1 6.73,26.93 6.73,28.6 7.24,29.11 17.17,29.11 17.55,29.49 17.55,40.67 18.08,41.2 35.4,41.2 37.54,43.34 37.54,45.8 38.1,46.36 43.94,46.36
  Top Layer w1.27: C8.2 R10.1
MCU_AIN4: length 54.2
  Top Layer w0.305: U4.13 48.74,44.04 48.51,43.81 47.12,43.81
  Top Layer w0.61: 14.22,26.99 14.22,27.71 14.83,28.32 17.91,28.32 18.34,28.75 18.34,39.93 18.82,40.41 35.72,40.41 38.33,43.02 38.33,43.54 38.61,43.81 47.12,43.81
  Top Layer w1.27: R12.1 14.14,26.91 14.22,26.99
MCU_PWR_EN: length 16
  Top Layer w1.016: R6.2 59.18,6.48 arc(59.44,5.85) 60.07,5.59 68.71,5.59 arc(69.03,5.72) 69.17,6.05 U3.3
RTC_IO: length 12.6
  Top Layer w0.305: U4.30 66.85,49.83 67.18,50.17 U6.6
RTC_RST: length 14.4
  Top Layer w0.305: U6.5 68.45,49.66 68.13,49.33 U4.29
RTC_SCLK: length 23.9
  Top Layer w0.305: U4.18 v1(51.24,48.01) ; v1(65.91,53.21) U6.7
  Bottom Layer w0.305: v1(65.91,53.21) 65.91,48.26 65.66,48.01 v1(51.24,48.01)
USR: length 36.8
  Top Layer w0.305: U4.33 60.98,51.33 61.09,51.44 61.09,53.85 61.98,54.74 75.82,54.74 76.84,53.72 76.84,51.69 77.09,51.44 78.38,51.44 R15.1
  Top Layer w0.61: 78.38,51.44 v1(78.38,49.91)
  Bottom Layer w0.61: 78.38,46.36 v1(79.12,46.36) ; 78.38,46.36 v1(78.38,49.91) ; 78.38,46.36 78.38,45.34 ; 78.38,46.36 v1(77.72,46.36) ; 78.38,45.34 v1(77.72,45.34) ; 78.38,45.34 v1(79.12,45.34)
WI-FI_RXD: length 53.9
  Top Layer w0.305: U4.6 36.02,50.33 35.71,50.64 35.71,77.95 34.9,78.77 23.14,78.77 22.73,78.36 R4.2
WI-FI_TXD: length 57.5
  Top Layer w0.305: R3.2 19.94,79.12 20.07,79.25 35.69,79.25 36.19,78.74 36.19,51.13 36.5,50.82 46.98,50.82 U4.5
$1N157: length 3
  Top Layer w0.914: U2.27 21.97,73.93 R4.1
$1N158: length 3
  Top Layer w0.914: U2.28 20.7,73.93 R3.1
$1N183: length 16.1
  Top Layer w0.457: H1.2 12.62,77.98 13.08,77.52 U2.34
$1N184: length 16
  Top Layer w0.457: U2.35 11.81,75.01 11.38,75.44 11.2,75.44 10.74,74.98 10.74,74.75 10.29,74.3 9.68,74.3 9.22,74.75 9.22,74.98 8.76,75.44 8.15,75.44 7.7,74.98 7.7,74.75 7.24,74.3 6.63,74.3 6.17,74.75 6.17,74.98 5.72,75.44 5.11,75.44 4.65,74.98 4.65,74.75 4.19,74.3 3.58,74.3 3.12,74.75 3.12,74.98 H1.1
$1N223: length 3.1
  Top Layer w0.914: U2.25 24.51,74.05 25.27,74.82
$1N393: length 6.7
  Top Layer w1.27: 5.72,39.75 6.75,38.71 R7.2
$1N403: length 6.4
  Top Layer w1.27: R8.2 10.5,39.45 10.8,39.75
$1N404: length 5.7
  Top Layer w1.27: CN3.1 6.75,19.96 R10.2
$1N405: length 5.8
  Top Layer w1.27: R12.2 10.5,20.24 CN3.2
$1N538: length 12.4
  Top Layer w0.305: R16.1 56.13,38.1 56.01,38.23 56.01,40.39 55.63,40.77 52.07,40.77 51.74,41.1 U4.19
$1N539: length 43.8
  Top Layer w0.305: H3.1 74.29,25.15 73.91,24.77 73.91,22.86 73.66,22.61 62.23,22.61 61.21,23.62 61.21,37.97 61.09,38.1 R16.2
$1N549: length 8.5
  Top Layer w0.305: R17.1 52.71,41.78 52.24,42.25 U4.20
$1N550: length 48.9
  Top Layer w0.305: H3.2 73.66,27.69 73.41,27.43 73.41,23.75 72.77,23.11 62.74,23.11 61.85,24 61.85,41.66 61.72,41.78 R17.2
$1N579: length 6.2
  Top Layer w0.61: LED1.1 R9.2
$1N580: length 18.4
  Top Layer w0.305: LED1.2 61.34,63.01 61.34,61.98 61.09,61.72 51.56,61.72 51.24,61.4 U4.43
$1N581: length 6.3
  Top Layer w0.61: LED2.1 53.96,71.89 R11.2
$1N601: length 6.2
  Top Layer w0.61: R13.2 46.4,71.95 LED3.1
$1N621: length 6.3
  Top Layer w0.61: R14.2 38.85,71.88 LED4.1
$1N641: length 12.1
  Top Layer w0.305: U4.45 50.24,62.66 49.78,63.12 46.46,63.12 LED3.2
$1N642: length 19.1
  Top Layer w0.305: LED4.2 38.86,63.17 38.86,61.98 39.12,61.72 49.4,61.72 49.74,61.39 U4.46
$1N643: length 11.5
  Top Layer w0.305: LED2.2 53.9,63.12 51.18,63.12 50.74,62.68 U4.44
$1N806: length 5.9
  Top Layer w0.254: X1.2 65.53,41.21 65.91,41.59 U6.2
$1N807: length 5.9
  Top Layer w0.254: U6.3 67.18,41.59 67.56,41.21 X1.1
$1N3385: length 6.4
  Top Layer w1.27: BUZ1.2 81.15,65.9 arc(81.19,65.81) Q1.3
$1N3396: length 3.1
  Top Layer w0.711: Q1.2 82.23,60.75 arc(82.21,60.71) R18.1

## Copper pours and planes (outline as drawn; the poured copper is in the pictures)
3.3V_MCU on Top Layer: 37.59,74.8 75.06,74.8 75.06,70.1 37.59,70.1
3.3V_MCU on Top Layer: 64.64,20.19 77.22,20.19 77.22,12.7 64.64,12.7
3.3V_WIFI on Top Layer: 19.92,29.26 43.56,29.26 43.56,19.05 19.92,19.05
+5V0 on Top Layer: 20.07,11.81 66.94,11.81 66.94,7.75 20.07,7.75
GND on Top Layer: 85.85,48.64 89.15,48.64 89.15,42.04 85.85,42.04
GND on Top Layer: 24.09,8.64 52.2,8.64 52.2,0.51 24.09,0.51
GND on Top Layer: 0,80 90,80 90,0 0,0
GND on Top Layer: 84.58,10.67 87.84,10.67 87.84,4.28 84.58,4.28
GND on Top Layer: 13.32,25.88 21.73,25.88 21.73,23.92 13.32,23.92
GND on Bottom Layer: 0,80 90,80 90,0 0,0
MCU_PWR_EN on Top Layer: 68.71,10.54 78.72,10.54 78.72,4.74 68.71,4.74
USR on Top Layer: 76.71,48.51 80,48.51 80,37.59 76.71,37.59
$1N495 on Top Layer: 12.7,12.45 19.43,12.45 19.43,6.73 12.7,6.73

Small or netless copper shapes (teardrops, artwork), in the pictures only: 1 on Top Layer

## Text on the board
Top Silkscreen Layer: TXD0 | RXD0 | 3V3_MCU | P3.1/TXD | P3.0/RXD | GND | TMS | TDI | TCK | TDO
